# Altium schematic sheet 485.SchDoc
size A4
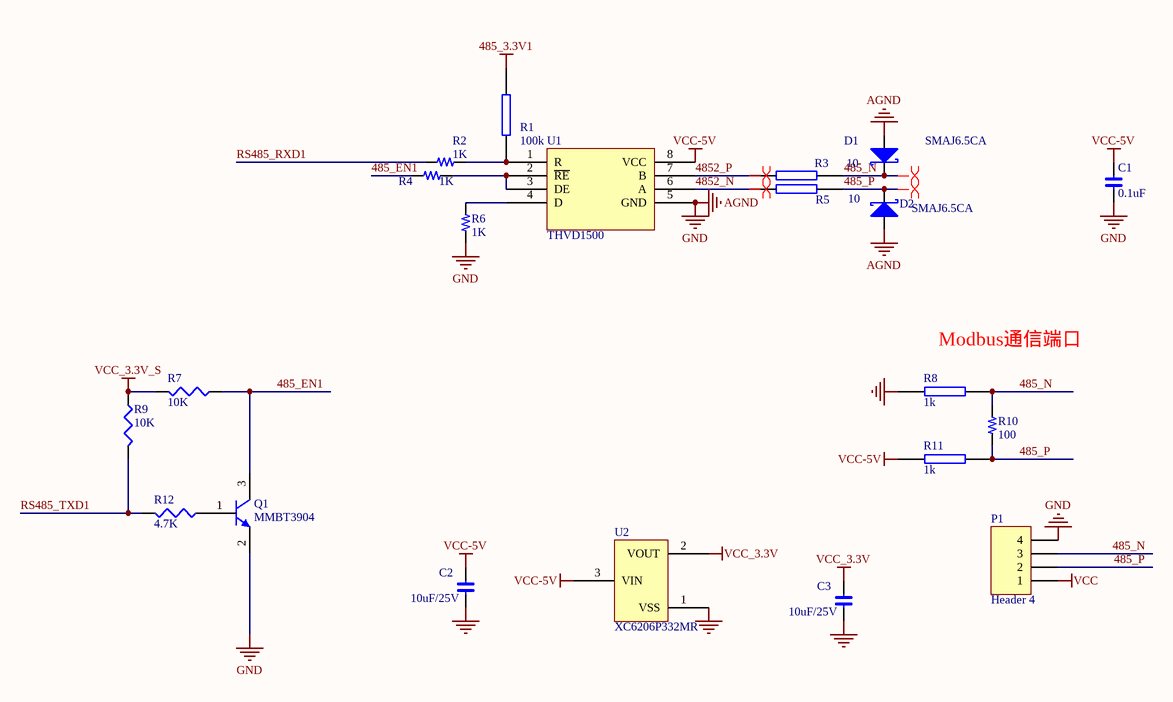
[diagram p0: 485.SchDoc]

## Parts
C1  0.1uF  [0603C]
C2  10uF/25V  [0603C]
C3  10uF/25V  [0603C]
D1  SMAJ6.5CA  [SMA]
D2  SMAJ6.5CA  [SMA]
P1  Header 4  [4X2.54MMZ]
Q1  MMBT3904  [SOT23-3]
R1  100k  [0603R]
R2  1K  [0603R]
R3  10  [1206R]
R4  1K  [0603R]
R5  10  [1206R]
R6  1K  [0603R]
R7  10K  [0603R]
R8  1k  [0603R]
R9  10K  [0603R]
R10  100  [0603R]
R11  1k  [0603R]
R12  4.7K  [0603R]
U1  THVD1500  [so-8]
U2  XC6206P332MR  [SOT23-3]

## Nets
485_3.3V1: R1.2
AGND: C1.1 C2.1 C3.1 D1.1(A) D2.1(A) P1.4 Q1.2(E) R6.2 R8.2 U1.5(GND) U2.1(VSS)  [also labelled GND]
VCC: P1.1
VCC-5V: C1.2 C2.2 R11.1 U1.8(VCC) U2.3(VIN)
VCC_3.3V: C3.2 U2.2(VOUT)
VCC_3.3V_S: R7.2 R9.1
485_EN1: Q1.3(C) R4.2 R7.1
485_N: D1.2(K) P1.3 R3.1 R8.1 R10.2
485_P: D2.2(K) P1.2 R5.1 R10.1 R11.2
4852_N: R5.2 U1.6(A)
4852_P: R3.2 U1.7(B)
RS485_RXD1: R2.2
RS485_TXD1: R9.2 R12.2
NetQ1_1: Q1.1(B) R12.1
NetR1_1: R1.1 R2.1 U1.1(R)
NetR4_1: R4.1 U1.2(~{RE}) U1.3(DE)
NetR6_1: R6.1 U1.4(D)

## Layout directives
differential pair: 485_N, 485_P, 4852_N, 4852_P

## Notes on the sheet
- (near R8) Modbus通信端口

## Library data of the parts
C1-C3 = C
D1 D2 = DIODE S: Schottky Diode
P1 = Header 4: Header, 4-Pin; LatestRevisionDate: 17-Jul-2002; LatestRevisionNote: Re-released for DXP Platform.; Publisher: Altium Limited
Q1 = NPN
R1 R3 R5 R8 R11 = RES2
R2 R4 R6 R10 = R
R7 R9 R12 = RES1: P: 1/8W
U1 = SN65HVD06D
U2 = XC6206P302MR